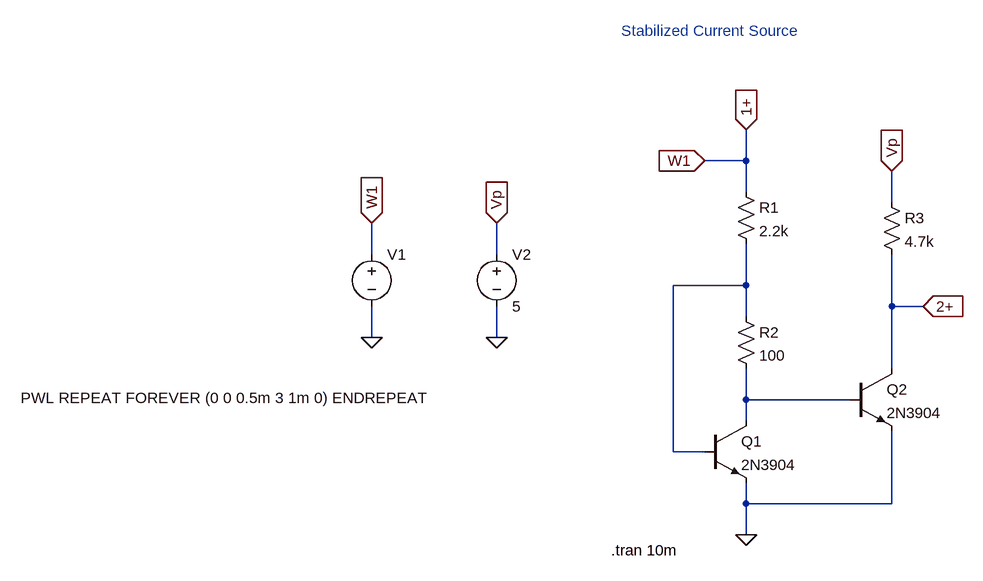
[diagram p0: schematic bjt_stab_curr_source_ltspice.asc]
bjt_stab_curr_source_ltspice.asc, the LTspice schematic file:
Version 4
SHEET 1 880 680
WIRE 208 -288 208 -336
WIRE 208 -288 144 -288
WIRE 208 -240 208 -288
WIRE 432 -224 432 -272
WIRE -368 -144 -368 -192
WIRE -176 -144 -176 -192
WIRE 208 -96 208 -160
WIRE 208 -96 96 -96
WIRE 432 -64 432 -144
WIRE 480 -64 432 -64
WIRE 208 -48 208 -96
WIRE -368 -16 -368 -64
WIRE -176 -16 -176 -64
WIRE 432 32 432 -64
WIRE 208 80 208 32
WIRE 368 80 208 80
WIRE 208 112 208 80
WIRE 96 160 96 -96
WIRE 144 160 96 160
WIRE 208 240 208 208
WIRE 432 240 432 128
WIRE 432 240 208 240
WIRE 208 288 208 240
FLAG 208 288 0
FLAG 144 -288 W1
IOPIN 144 -288 In
FLAG -368 -16 0
FLAG -368 -192 W1
IOPIN -368 -192 In
FLAG 432 -272 Vp
IOPIN 432 -272 In
FLAG -176 -16 0
FLAG -176 -192 Vp
IOPIN -176 -192 In
FLAG 208 -336 1+
IOPIN 208 -336 In
FLAG 480 -64 2+
IOPIN 480 -64 In
SYMBOL res 192 -256 R0
SYMATTR InstName R1
SYMATTR Value 2.2k
SYMBOL res 192 -64 R0
SYMATTR InstName R2
SYMATTR Value 100
SYMBOL voltage -368 -160 R0
WINDOW 3 -540 237 Left 2
SYMATTR Value PWL REPEAT FOREVER (0 0 0.5m 3 1m 0) ENDREPEAT
SYMATTR InstName V1
SYMBOL npn 144 112 R0
SYMATTR InstName Q1
SYMATTR Value 2N3904
SYMBOL npn 368 32 R0
SYMATTR InstName Q2
SYMATTR Value 2N3904
SYMBOL res 416 -240 R0
SYMATTR InstName R3
SYMATTR Value 4.7k
SYMBOL voltage -176 -160 R0
WINDOW 123 0 0 Left 0
WINDOW 39 0 0 Left 0
SYMATTR InstName V2
SYMATTR Value 5
TEXT 0 312 Left 2 !.tran 10m
TEXT 16 -488 Left 2 ;Stabilized Current Source

The netlist it stands for:
* bjt_stab_curr_source_ltspice.asc
R1 1+ N001 2.2k
R2 N001 N002 100
V1 1+ 0 PWL REPEAT FOREVER (0 0 0.5m 3 1m 0) ENDREPEAT
Q1 N002 N001 0 0 2N3904
Q2 2+ N002 0 0 2N3904
R3 Vp 2+ 4.7k
V2 Vp 0 5
.model NPN NPN
.model PNP PNP
.lib standard.bjt
.tran 10m
* Stabilized Current Source
.backanno
.end